# EasyEDA Pro project ProPrj_SRC_Robot2025_V1.0_2026-09-06.epro, schematic Schematic-IR
Board Name: IR_Board; Create Date: 2025-07-01; Page Name: P1; Project Name: SRC_Robot2025_V1.0; Schematic Name: Schematic-IR; Update Date: 2025-07-08; Company: 嘉立创EDA; Page Size: A4; Version: V1.0
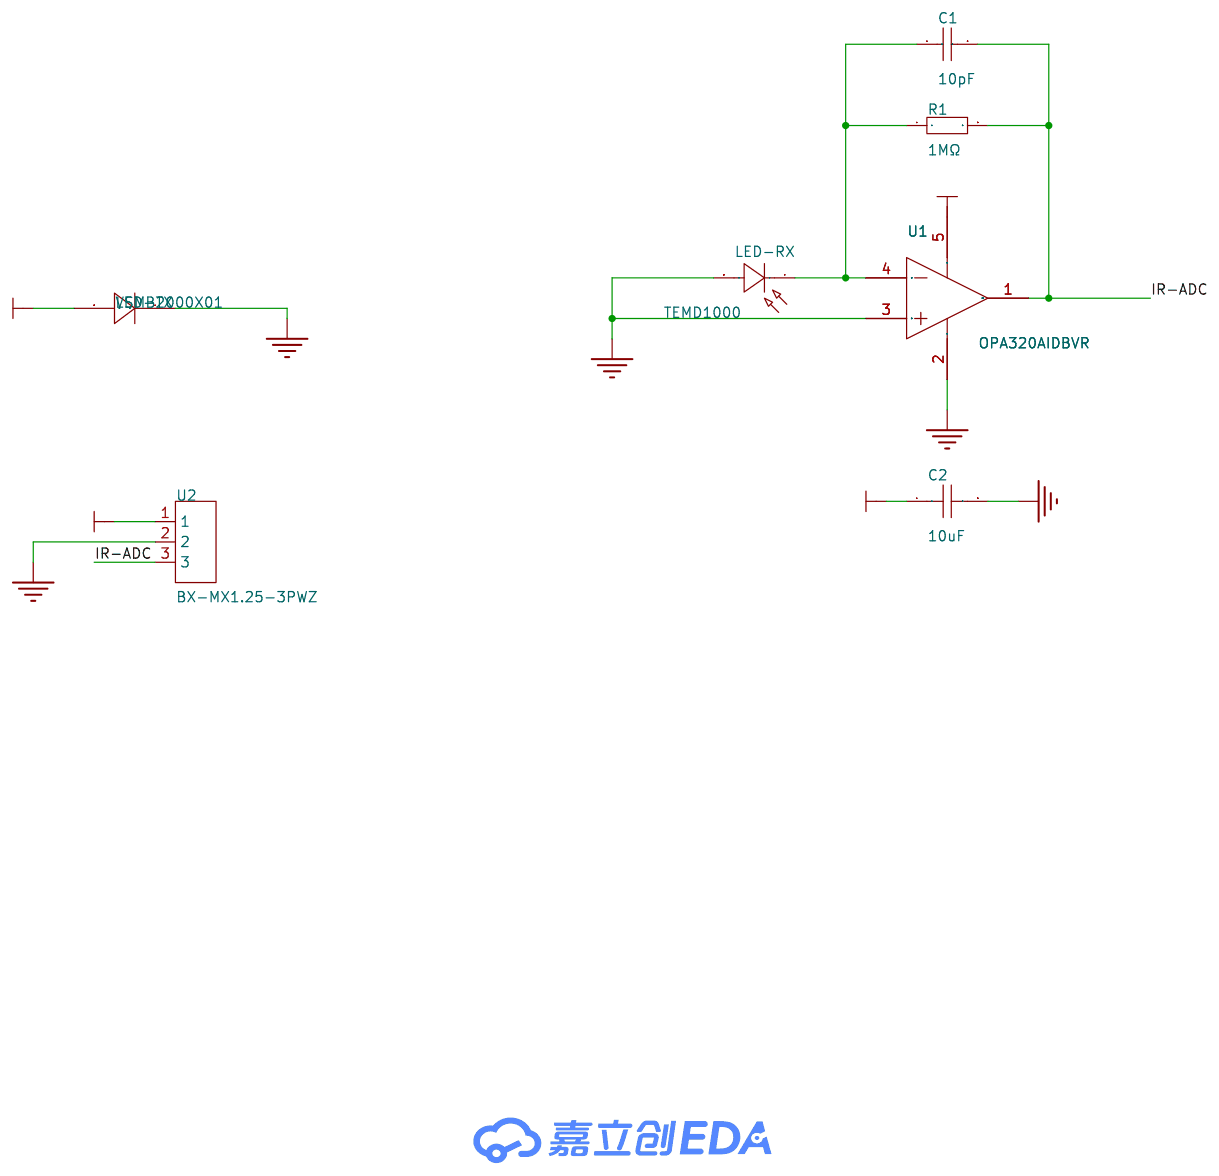
[diagram p5: schematic sheet]

## Parts
C1  10pF  [C0603]
C2  10uF  [C0603]
LED-RX  TEMD1000  [VSMB2000X01]
LED-TX  VSMB2000X01  [VSMB2000X01]
R1  1MΩ  [R0603]
U1  OPA320AIDBVR  [SOT-23-5_L3.0-W1.7-P0.95-LS2.8-BR]
U2  BX-MX1.25-3PWZ  [CONN-TH_3P-P1.25_BX-MX1.25-3PWZ]

## Library data of the parts
C1 = CL10C100JB8NNNC: 容值:10pF;精度:±5%;额定电压:50V;材质(温度系数):C0G;; LCSC Part Name: 10pF ±5% 50V; Supplier Part: C1634; Manufacturer: SAMSUNG(三星); Supplier Footprint: 0603; JLCPCB Part Class: 基础库; Datasheet: https://atta.szlcsc.com/upload/public/pdf/source/20160218/1457707763339.pdf; Supplier: LCSC; Tolerance: ±5%; Voltage Rated: 50V; Temperature Coefficient: C0G
C2 = CL10A106KP8NNNC: 容值:10uF;精度:±10%;额定电压:10V;材质(温度系数):X5R;; LCSC Part Name: 10uF ±10% 10V; Supplier Part: C19702; Manufacturer: SAMSUNG(三星); Supplier Footprint: 0603; JLCPCB Part Class: 基础库; Datasheet: https://atta.szlcsc.com/upload/public/pdf/source/20160218/1457707763339.pdf; Supplier: LCSC; Tolerance: ±10%; Voltage Rated: 10V; Temperature Coefficient: X5R
LED-RX = TEMD1000: 反向电压:60V;接收角:-;峰值波长:940nm;频谱范围:790nm~1050nm;暗电流:1nA;; Supplier Part: C3211065; Manufacturer: VISHAY(威世); JLCPCB Part Class: 扩展库; Datasheet: https://atta.szlcsc.com/upload/public/pdf/source/20231211/9A044E92724D4DD477D69C6D67E515FA.pdf; Supplier: LCSC; DC Reverse Voltage: 60V; Peak  Wavelength: 940nm; Spectral Range: 790nm~1050nm; Current Dark: 1nA; Operating Temperature: -40℃~+85℃
LED-TX = VSMB2000X01
R1 = 0603WAF1004T5E: 电阻类型:厚膜电阻;阻值:1MΩ;精度:±1%;功率:100mW;最大工作电压:75V;温度系数:±100ppm/℃;; LCSC Part Name: 1MΩ ±1% 100mW 厚膜电阻; Supplier Part: C22935; Manufacturer: UNI-ROYAL(厚声); Supplier Footprint: 0603; JLCPCB Part Class: 基础库; Datasheet: https://atta.szlcsc.com/upload/public/pdf/source/20200306/C422600_1E6D84923E4A46A82E41ADD87F860B5C.pdf; Supplier: LCSC; Type: 厚膜电阻; Tolerance: ±1%; Power(Watts): 100mW; Overload Voltage (Max): 75V; Temperature Coefficient: ±100ppm/℃; Operating Temperature Range: -55℃~+155℃
U1 = OPA320AIDBVR: 放大器数:单路;增益带宽积(GBP):20MHz;输入偏置电流(Ib):0.2pA;压摆率(SR):10V/us;轨到轨:-;; Supplier Part: C92494; Manufacturer: TI(德州仪器); Supplier Footprint: SOT-23-5; JLCPCB Part Class: 扩展库; Datasheet: https://www.ti.com/cn/lit/gpn/opa320; Supplier: LCSC; Number of Channels: 单路; Gain Bandwidth Product: 20MHz; Ib - Input Bias Current: 0.2pA; Slew Rate: 10V/us; Output Current: 65mA; Operating Temperature: -40℃~+125℃
U2 = BX-MX1.25-3PWZ: 插针结构:1x3P;间距:1.25mm;安装方式:弯插;参考系列:PicoBlade(MX 1.25);总PIN数:3P;排数:1;每排PIN数:3;行距:-;额定电流:1A;触头材质:黄铜;触头镀层:锡;工作温度:-25℃~+85℃;; LCSC Part Name: 1x3P 间距:1.25mm 弯插 系列:PicoBlade(MX 1.25); Supplier Part: C18077928; Manufacturer: Bossie(博锡); Supplier Footprint: 弯插,P=1.25mm; JLCPCB Part Class: 扩展库; Datasheet: https://atta.szlcsc.com/upload/public/pdf/source/20231017/BD7559DF3E11F8C4B6ED603A7C2DEC33.pdf; Supplier: LCSC; Pins Structure: 1x3P; Pitch: 1.25mm; Mounting Type: 弯插; Reference Series: PicoBlade(MX 1.25); Number of Pins: 3P; Number of Rows: 1; Number of PINs Per Row: 3; Current Rating: 1A; Contact Material: 黄铜; Contact Plating: 锡; Operating Temperature: -25℃~+85℃; Voltage Rating: 125V; Plastic Material: PA; Color: 白色; Z-Height of the Board: 3.3mm; X-Length of Bottom Edge on Board (Spacing Line): 5.65mm; Y-Width of Bottom Edge on Board: 4.6mm

## Nets
3V3: C2.1 LED-TX.2 U1.5(V+) U2.1
GND: C2.2 LED-RX.2(A) LED-TX.1 U1.2(V-) U1.3(IN+) U2.2
IR-ADC: C1.2 R1.2 U1.1(OUT) U2.3
$1N304: C1.1 LED-RX.1(K) R1.1 U1.4(IN-)
